# EAGLE design ParticleBase (EAGLE 7.3.0)
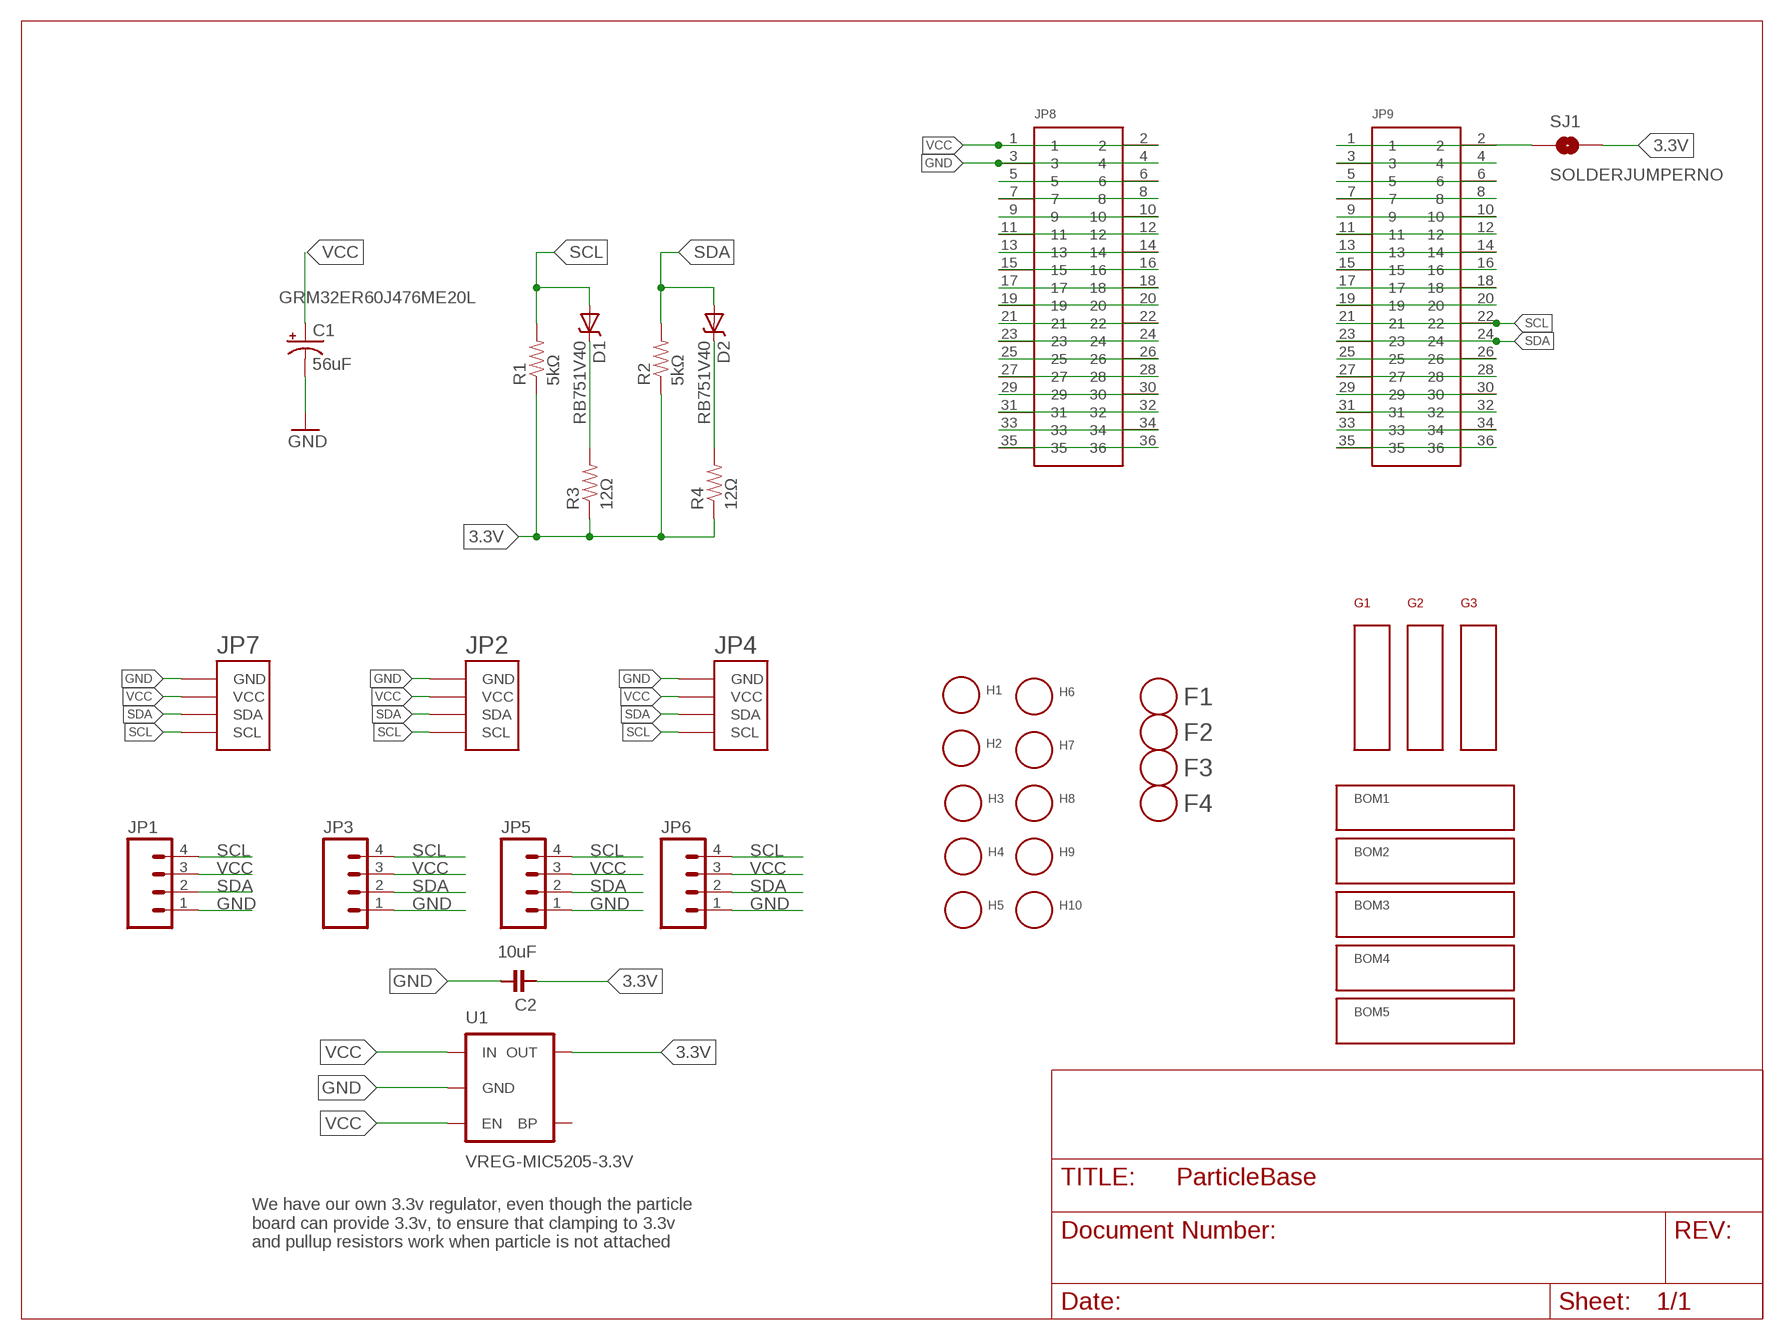
[diagram p0: schematic, sheet 1]
BOM1 (BOM_ITEM): PARTNUM: SJ61A4
BOM2 (BOM_ITEM): PARTNUM: SJ61A4
BOM3 (BOM_ITEM): PARTNUM: SJ61A4
BOM4 (BOM_ITEM): PARTNUM: SJ61A4
BOM5 (BOM_ITEM): DESCRIPTION: PCB; PARTNUM: Particle Base PCB
FRAME1 (LETTER_L): BOM: EXCLUDE

## Parts
C1  56uF  CAPACITOR-POL-56UF-25V  [PANASONIC_D]
C2  10uF  CAPACITOR-10UF  [0603]
D1  RB751V40  DIODE-SCHOTTKY-BAT60A  [SOD-323]
D2  RB751V40  DIODE-SCHOTTKY-BAT60A  [SOD-323]
F1  FIDUCIAL  [FIDUCIAL_1MM]
F2  FIDUCIAL  [FIDUCIAL_1MM]
F3  FIDUCIAL  [FIDUCIAL_1MM]
F4  FIDUCIAL  [FIDUCIAL_1MM]
G1  CARD-GUIDE  [CARD-GUIDE-2]
G2  CARD-GUIDE  [CARD-GUIDE-2]
G3  CARD-GUIDE  [CARD-GUIDE-2]
H1  HOLE#2  [HOLE-#2]
H2  HOLE#2  [HOLE-#2]
H3  HOLE#2  [HOLE-#2]
H4  HOLE#2  [HOLE-#2]
H5  HOLE#2  [HOLE-#2]
H6  HOLE#2  [HOLE-#2]
H7  HOLE#2  [HOLE-#2]
H8  HOLE#2  [HOLE-#2]
H9  HOLE#2  [HOLE-#2]
H10  HOLE#2  [HOLE-#2]
JP1  M04LOCK  [1X04_LOCK]
JP2  HEADER-MODULO  [JST-PA-SIDE-SMD]
JP3  M04LOCK  [1X04_LOCK]
JP4  HEADER-MODULO  [JST-PA-SIDE-SMD]
JP5  M04LOCK  [1X04_LOCK]
JP6  M04LOCK  [1X04_LOCK]
JP7  HEADER-MODULO  [JST-PA-SIDE-SMD]
JP8  HEADER-2X18  [2X18-LOCK]
JP9  HEADER-2X18  [2X18-LOCK]
R1  5kΩ  RESISTOR-5KΩ  [0603]
R2  5kΩ  RESISTOR-5KΩ  [0603]
R3  12Ω  RESISTOR-12Ω  [0603]
R4  12Ω  RESISTOR-12Ω  [0603]
SJ1  SOLDERJUMPERNO  [SJ_2S-NO]
U1  VREG-MIC5205-3.3V  [SOT23-5]

## Nets
3.3V: C2.2 R1.1 R2.1 R3.1 R4.1 SJ1.2 U1.5(OUT)
GND: C1.- C2.1 JP1.1 JP2.1(GND) JP3.1 JP4.1(GND) JP5.1 JP6.1 JP7.1(GND) JP8.3 JP8.4 U1.2(GND)
N$1: JP8.5 JP8.6
N$2: JP8.7 JP8.8
N$3: JP8.9 JP8.10
N$4: JP8.11 JP8.12
N$5: JP8.13 JP8.14
N$6: JP8.15 JP8.16
N$7: JP8.17 JP8.18
N$8: JP8.19 JP8.20
N$9: JP8.21 JP8.22
N$10: JP8.23 JP8.24
N$11: JP8.25 JP8.26
N$12: JP8.27 JP8.28
N$13: JP8.29 JP8.30
N$14: JP9.5 JP9.6
N$15: JP8.31 JP8.32
N$16: D1.C R3.2
N$17: JP8.33 JP8.34
N$18: JP8.35 JP8.36
N$19: D2.C R4.2
N$20: JP9.3 JP9.4
N$21: JP9.7 JP9.8
N$22: JP9.9 JP9.10
N$23: JP9.11 JP9.12
N$24: JP9.13 JP9.14
N$25: JP9.15 JP9.16
N$26: JP9.17 JP9.18
N$27: JP9.19 JP9.20
N$28: JP9.25 JP9.26
N$29: JP9.27 JP9.28
N$30: JP9.29 JP9.30
N$31: JP9.31 JP9.32
N$32: JP9.33 JP9.34
N$33: JP9.35 JP9.36
N$34: JP9.1 JP9.2 SJ1.1
SCL: D1.A JP1.4 JP2.4(SCL) JP3.4 JP4.4(SCL) JP5.4 JP6.4 JP7.4(SCL) JP9.21 JP9.22 R1.2
SDA: D2.A JP1.2 JP2.3(SDA) JP3.2 JP4.3(SDA) JP5.2 JP6.2 JP7.3(SDA) JP9.23 JP9.24 R2.2
VCC: C1.+ JP1.3 JP2.2(VCC) JP3.3 JP4.2(VCC) JP5.3 JP6.3 JP7.2(VCC) JP8.1 JP8.2 U1.1(IN) U1.3(EN)
Unconnected: H1.P$1(HOLE) H2.P$1(HOLE) H3.P$1(HOLE) H4.P$1(HOLE) H5.P$1(HOLE) H6.P$1(HOLE) H7.P$1(HOLE) H8.P$1(HOLE) H9.P$1(HOLE) H10.P$1(HOLE) U1.4(BP)

## Notes on the sheet
- GRM32ER60J476ME20L
- We have our own 3.3v regulator, even though the particle
  board can provide 3.3v, to ensure that clamping to 3.3v
  and pullup resistors work when particle is not attached

## Library data of the parts
C1 = Modulo:CAPACITOR-POL; PARTNUM: EMVA250ADA560MF55G
C2 = Modulo:CAPACITOR: Capacitor; PARTNUM: GRM188R61C106MA73D
D1 D2 = Modulo:DIODE-SCHOTTKY; PARTNUM: RB751V40
F1-F4 = Modulo:FIDUCIAL; BOM: EXCLUDE
G1 G3 = Modulo:CARD-GUIDE; PARTNUM: HCG-201-165
G2 = Modulo:CARD-GUIDE; PARTNUM: HCG-202-165
H1-H3 = Modulo:HOLE; NOBOM: 1; PARTNUM: EXCLUDE
H4-H10 = Modulo:HOLE; PARTNUM: EXCLUDE
JP1 JP3 JP5 JP6 = SparkFun-Connectors:M04: Header 4 Standard 4-pin 0.1" header. Use with straight break away headers (SKU : PRT-00116), right angle break away headers (PRT-00553), swiss pins (PRT-00743), machine pins (PRT-00117), and female headers (PRT-00115). Molex polarized connector foot print use with SKU : PRT-08231 with associated crimp pins and housings. 1MM SMD Version SKU: PRT-10208; PARTNUM: M20-9750446
JP2 JP4 JP7 = Modulo:HEADER-MODULO; PARTNUM: 4P-SMD-2.0-90D
JP8 JP9 = Modulo:HEADER-2X18; PARTNUM: 12x2 Receptacle
R1 R2 = Modulo:RESISTOR: Resistor Basic schematic elements and footprints for 0603, 1206, and PTH resistors.; PARTNUM: ERJ-3EKF5101V
R3 R4 = Modulo:RESISTOR: Resistor Basic schematic elements and footprints for 0603, 1206, and PTH resistors.; PARTNUM: ERJ-PA3J120V
SJ1 = SparkFun-Passives:SOLDERJUMPER: Solder Jumper Standard SMD solder jumper. Used to automate production. Two varients : Normally Open and Normally Closed are the same, but have different paste layers. NC will have a large amount of paste and should jumper during reflow.
U1 = Modulo:VREG-MIC5205: V_REG MIC5219 Standard 3.3V and 5V 150mA LDO voltage regulator in SOT-23 layout. Micrel part MIC5205. BP (by-pass) pin is used to lower output noise with 470pF cap, may be left open.; PARTNUM: MIC5205-3.3YM5 TR

## Board
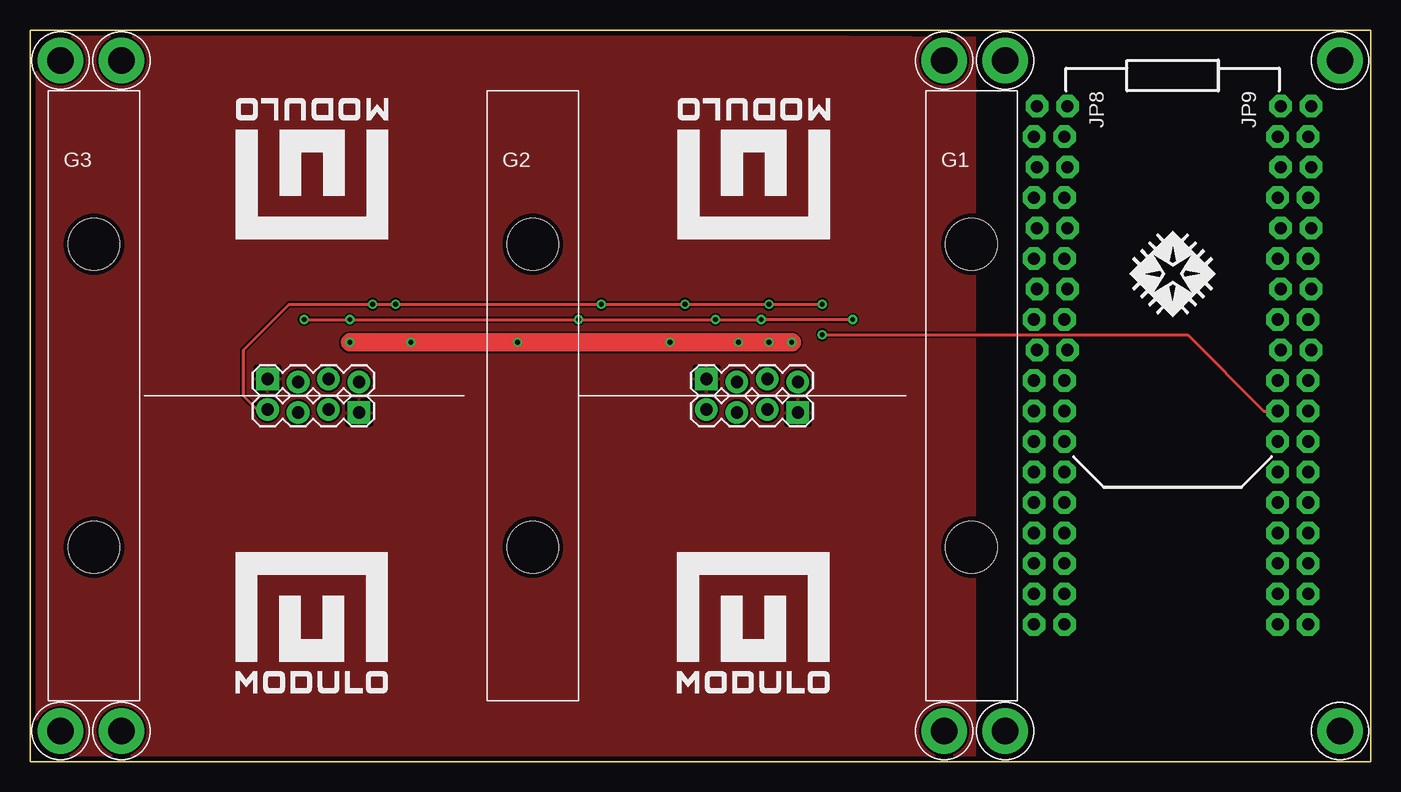
[diagram p1: board, top side]
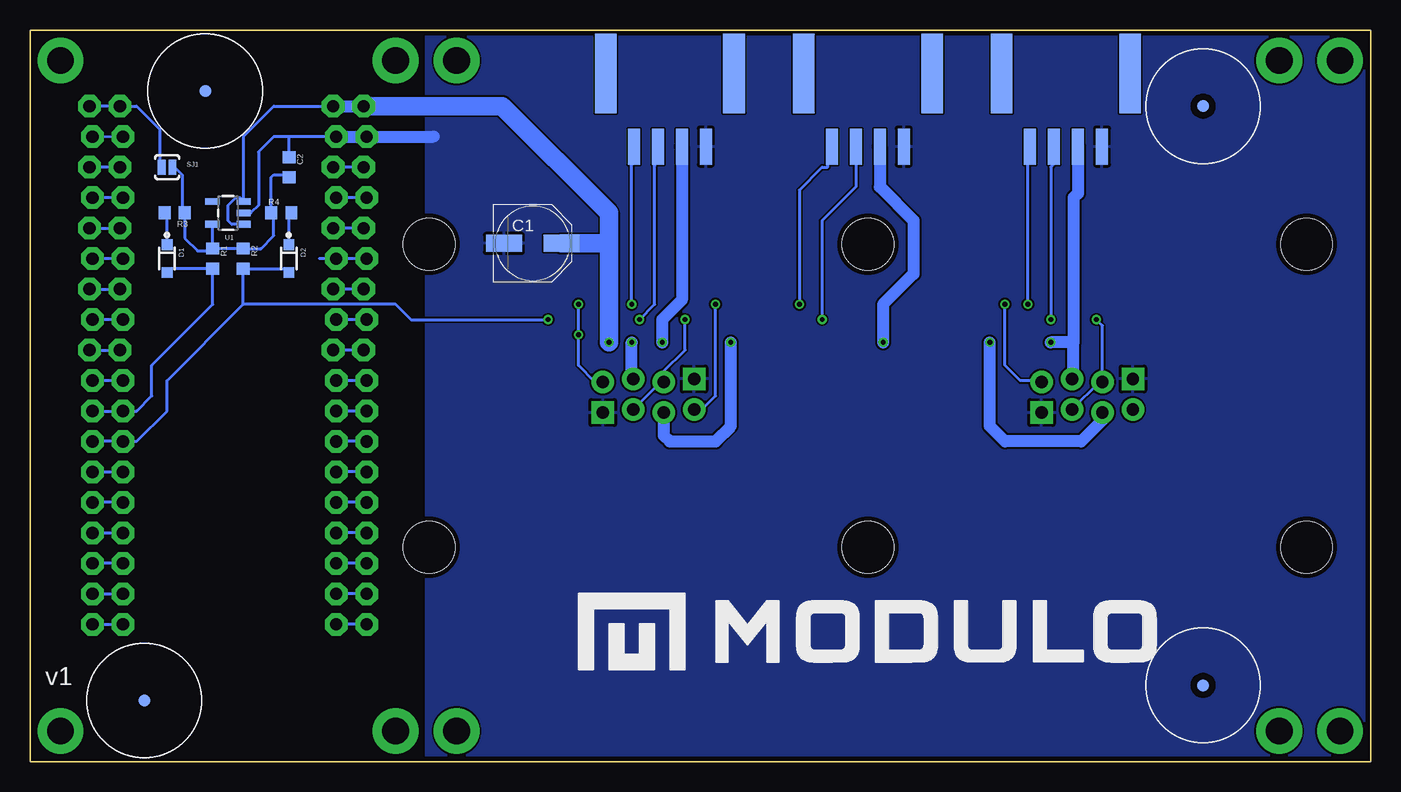
[diagram p2: board, bottom side, seen from below]

Size 111.76 x 60.96 mm. Coordinates in mm from the lower left corner, seen from the top.
Outline: 0,0 0,60.96 111.76,60.96 111.76,0 0,0
Copper layers (1*16): Top 0.0356mm / dielectric 1.5011mm / Bottom 0.0356mm
Design rules "Modulo": minimum track width 6mil, minimum drill 13mil, track to track 6mil, track to pad 6mil, pad to pad 6mil, via to via 6mil, smd to smd 6mil, copper to edge 15mil, drill to drill 6mil, minimum pad ring 7mil, minimum via ring 7mil, stop-mask expansion 3mil, vias tented up to drill 25mil, thermal gap 10mil

### Footprints (pad centres in the part's own frame; a part is rotated, then mirrored left to right if it is on the bottom)
PANASONIC_D = smd 3 x 1.4: + 2.4,0; - -2.4,0
0603 = smd 0.991 x 1.092: 1 -0.838,0; 2 0.838,0
SOD-323 = smd 0.9 x 0.9: A 1.15,0; C -1.15,0
FIDUCIAL_1MM = smd 1 x 1: 1 0,0
CARD-GUIDE-2 = hole 4.293: 0,-12.624; 0,12.624
HOLE-#2 = drill 2.223 pad 3.81: P$1 0,0
1X04_LOCK = drill 1.016 pad 1.88 square: 1 0,0.127 | drill 1.016 pad 1.88: 2 2.54,-0.127; 3 5.08,0.127; 4 7.62,-0.127
JST-PA-SIDE-SMD = smd 1 x 3: 1 -3,9.726; 2 -1,9.726; 3 1,9.726; 4 3,9.726 | smd 1.8 x 6.6: R1 -5.35,3.626; R2 5.35,3.626
2X18-LOCK = drill 1.016 pad 1.88 octagon: 1 -21.59,-1.143; 2 -21.59,1.397; 3 -19.05,-1.397; 4 -19.05,1.143; 5 -16.51,-1.143; 6 -16.51,1.397; 7 -13.97,-1.397; 8 -13.97,1.143; 9 -11.43,-1.143; 10 -11.43,1.397; 11 -8.89,-1.397; 12 -8.89,1.143; 13 -6.35,-1.143; 14 -6.35,1.397; 15 -3.81,-1.397; 16 -3.81,1.143; 17 -1.27,-1.143; 18 -1.27,1.397; 19 1.27,-1.397; 20 1.27,1.143; 21 3.81,-1.397; 22 3.81,1.143; 23 6.35,-1.397; 24 6.35,1.143; 25 8.89,-1.397; 26 8.89,1.143; 27 11.43,-1.397; 28 11.43,1.143; 29 13.97,-1.397; 30 13.97,1.143; 31 16.51,-1.397; 32 16.51,1.143; 33 19.05,-1.397; 34 19.05,1.143; 35 21.59,-1.397; 36 21.59,1.143
SJ_2S-NO = smd 0.635 x 1.27: 1 -0.45,0; 2 0.45,0
SOT23-5 = smd 0.55 x 1.2: 1 -0.95,-1.3; 2 0,-1.3; 3 0.95,-1.3; 4 0.95,1.3; 5 -0.95,1.3

### Placement (x,y rotation side)
C1  69.85,43.18 0 bottom
C2  90.17,49.53 270 bottom
D1  100.33,41.91 270 bottom
D2  90.17,41.91 270 bottom
F1  13.97,6.35 0 bottom
F2  13.97,54.61 0 bottom
F3  102.23,5.08 0 bottom
F4  97.16,55.88 0 bottom
G1  78.49,30.48 0 top
G2  41.91,30.48 0 top
G3  5.33,30.48 0 top
H1  2.54,2.54 0 top
H2  2.54,58.42 0 top
H3  76.2,58.42 0 top
H4  81.28,58.42 0 top
H5  109.22,2.54 0 top
H6  7.62,2.54 0 top
H7  7.62,58.42 0 top
H8  76.2,2.54 0 top
H9  81.28,2.54 0 top
H10  109.22,58.42 0 top
JP1  19.81,31.75 0 top
JP2  41.91,60.96 180 bottom
JP3  27.43,29.21 180 top
JP4  58.42,60.96 180 bottom
JP5  56.39,31.75 0 top
JP6  64.01,29.21 180 top
JP7  25.4,60.96 180 bottom
JP8  85.09,33.02 270 top
JP9  105.41,33.02 270 top
R1  96.52,41.91 270 bottom
R2  93.98,41.91 270 bottom
R3  99.69,45.72 180 bottom
R4  90.81,45.72 0 bottom
SJ1  100.33,49.53 0 bottom
U1  95.25,45.72 90 bottom
U$1  [LOGO-0.5]  23.5,5.71 0 top
U$2  [LOGO-0.5]  60.33,5.71 0 top
U$3  [LOGO-0.5]  60.33,55.24 180 top
U$4  [LOGO-0.5]  23.5,55.24 180 top
U$5  [LOGO-HOR-0.25]  66.04,10.79 0 bottom
U$6  [WORKS_WITH_PARTICLE_LOGO_LARGE]  95.25,40.64 0 top

### Tracks (layer width: path | path; a pad name or v marks a point on that pad's centre or on a via)
3.3V
  Bottom 0.254: R1.1 R2.1 92.51,42.75 91.44,43.81 91.44,45.52 R4.1 91.64,48.69 91.44,48.9 90.37,48.9 C2.2 | R1.1 96.72,42.55 97.79,42.55 98.86,43.61 R3.1 99.06,45.92 99.06,48.9 99.69,49.53 SJ1.2 | R1.1 96.52,44.74 U1.5
GND
  Bottom 0.254: JP8.4 90.17,52.07 | 90.17,52.07 91.44,52.07 92.71,50.8 92.71,46.35 93.34,45.72 U1.2 | C2.1 90.17,52.07
  Bottom 1.016: JP8.4 JP8.3 78.11,52.07
  pour Top: 0,0 0,60.96 78.74,60.33 78.74,-0.64
  pour Bottom: 0,0 0,60.96 78.74,60.96 78.74,0
N$1
  Bottom 0.254: JP8.5 JP8.6
N$2
  Bottom 0.254: JP8.7 JP8.8
N$3
  Bottom 0.254: JP8.9 JP8.10
N$4
  Bottom 0.254: JP8.11 JP8.12 87.63,41.91
N$5
  Bottom 0.254: JP8.13 JP8.14
N$6
  Bottom 0.254: JP8.15 JP8.16
N$7
  Bottom 0.254: JP8.17 JP8.18
N$8
  Bottom 0.254: JP8.19 JP8.20
N$9
  Bottom 0.254: JP8.21 JP8.22
N$10
  Bottom 0.254: JP8.23 JP8.24
N$11
  Bottom 0.254: JP8.25 JP8.26
N$12
  Bottom 0.254: JP8.27 JP8.28
N$13
  Bottom 0.254: JP8.29 JP8.30
N$14
  Bottom 0.254: JP9.5 JP9.6
N$15
  Bottom 0.254: JP8.31 JP8.32
N$16
  Bottom 0.254: D1.C 100.33,45.52 R3.2
N$17
  Bottom 0.254: JP8.33 JP8.34
N$18
  Bottom 0.254: JP8.35 JP8.36
N$19
  Bottom 0.254: D2.C 90.17,45.52 R4.2
N$20
  Bottom 0.203: JP9.4 JP9.3
N$21
  Bottom 0.254: JP9.7 JP9.8
N$22
  Bottom 0.254: JP9.10 JP9.9
N$23
  Bottom 0.254: JP9.11 JP9.12
N$24
  Bottom 0.254: JP9.14 JP9.13
N$25
  Bottom 0.254: JP9.15 JP9.16
N$26
  Bottom 0.254: JP9.18 JP9.17
N$27
  Bottom 0.254: JP9.19 JP9.20
N$28
  Bottom 0.254: JP9.26 JP9.25
N$29
  Bottom 0.254: JP9.27 JP9.28
N$30
  Bottom 0.254: JP9.30 JP9.29
N$31
  Bottom 0.254: JP9.31 JP9.32
N$32
  Bottom 0.254: JP9.34 JP9.33
N$33
  Bottom 0.254: JP9.36 JP9.35
N$34
  Bottom 0.254: JP9.2 JP9.1 102.87,54.61 100.97,52.7 100.97,49.72 SJ1.1
SCL  (via drill 0.41)
  Top 0.254: v66.04,38.1 v61.59,38.1 v54.61,38.1 v47.62,38.1 v30.48,38.1 v28.57,38.1 21.59,38.1 17.78,34.29 17.78,30.48 19.05,29.21 19.68,29.21 JP3.4 | v66.04,35.56 96.52,35.56 102.87,29.21 JP9.21
  Bottom 0.254: v66.04,38.1 v66.04,35.56 66.04,33.02 64.64,31.62 JP5.4 | v47.62,38.1 47.62,47.62 45.72,49.53 45.26,49.53 JP2.4 | JP9.22 JP9.21 102.87,29.21 101.6,30.48 101.6,33.02 96.52,38.1 R1.2 100.02,41.07 D1.A | JP1.4 27.81,31.62 27.94,31.75 29.21,31.75 30.48,33.02 v30.48,38.1 | JP6.4 55.75,29.34 54.61,30.48 v54.61,38.1 | v28.57,38.1 28.57,49.71 JP7.4 | v61.59,38.1 61.59,49.71 JP4.4
SDA  (via drill 0.41)
  Top 0.254: v22.86,36.83 v26.67,36.83 v45.72,36.83 v57.15,36.83 v60.96,36.83 v68.58,36.83
  Bottom 0.254: JP9.24 JP9.23 102.87,26.67 100.33,29.21 100.33,31.75 93.98,38.1 | v68.58,36.83 80.01,36.83 81.28,38.1 93.98,38.1 | JP3.2 22.61,31.62 JP1.2 22.35,36.32 v22.86,36.83 | v57.15,36.83 57.15,34.29 58.93,32.51 JP5.2 59.18,31.62 JP6.2 | 93.98,38.1 R2.2 90.48,41.07 D2.A | JP7.3 26.4,49.8 26.67,49.53 v26.67,36.83 | v60.96,36.83 59.69,38.1 59.69,49.61 JP4.3 | JP2.3 42.91,47.9 45.72,45.09 v45.72,36.83
VCC  (via drill 0.41)
  Top 1.524: v26.67,34.92 v31.75,34.92 v40.64,34.92 v53.34,34.92 v59.05,34.92 v61.59,34.92 v63.5,34.92
  Bottom 0.254: U1.1 94.94,44.77 95.25,45.09 95.25,46.35 94.61,46.99 94.27,46.99 U1.3 93.95,52.1 91.44,54.61 JP8.2
  Bottom 1.016: JP8.2 JP8.1 | JP6.3 58.93,27.18 58.42,26.67 54.61,26.67 53.34,27.94 v53.34,34.92 | JP5.3 61.47,32.26 61.59,32.38 v61.59,34.92 | JP3.3 22.35,28.45 24.13,26.67 30.48,26.67 31.75,27.94 v31.75,34.92 | JP1.3 24.77,32.38 24.77,34.92 | 24.77,34.92 v26.67,34.92 | JP7.2 24.4,47.35 24.77,46.99 24.77,34.92 | JP2.2 40.91,47.9 38.1,45.09 38.1,40.64 40.64,38.1 v40.64,34.92 | JP4.2 57.42,38.47 59.05,36.83 v59.05,34.92
  Bottom 1.524: 63.5,43.18 63.5,45.72 72.39,54.61 JP8.1 | 63.5,43.18 v63.5,34.92 | C1.+ 63.5,43.18

### Text on the board
bPlace: v1